# Altium schematic sheet HardwareSetup.SchDoc
size A
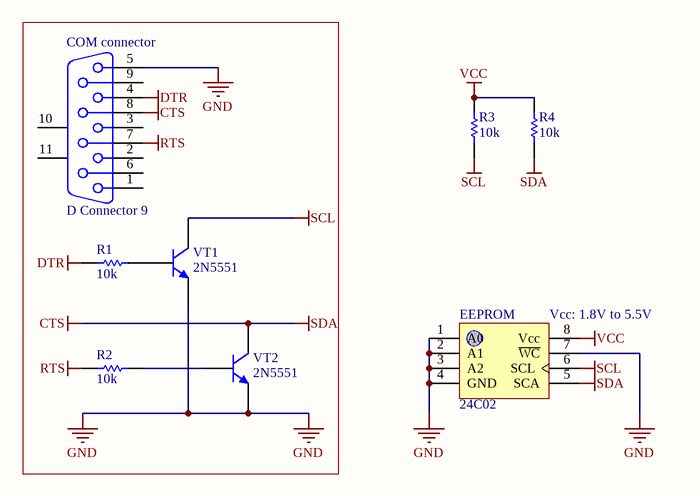
[diagram p0: HardwareSetup.SchDoc]

## Parts
COM_connector  D Connector 9  [DSUB1.385-2H9]
EEPROM  24C02  [DIP-8]
R1  value 10k  [AXIAL-0.3]  (hidden comment: R1)
R2  value 10k  [AXIAL-0.3]  (hidden comment: R1)
R3  value 10k  [AXIAL-0.3]  (hidden comment: R1)
R4  value 10k  [AXIAL-0.3]  (hidden comment: R1)
VT1  2N5551  [TO-92B]
VT2  2N5551  [TO-92B]

## Nets
CTS: COM_connector.8 EEPROM.5(SCA) R4.1 VT2.3(C)  [also labelled SDA]
DTR: COM_connector.4 R1.1
GND: COM_connector.5 EEPROM.1(A0) EEPROM.2(A1) EEPROM.3(A2) EEPROM.4(GND) EEPROM.7(~{WC}) VT1.1(E) VT2.1(E)
RTS: COM_connector.7 R2.1
SCL: EEPROM.6(SCL) R3.1 VT1.3(C)
VCC: EEPROM.8(Vcc) R3.2 R4.2
NetR1_2: R1.2 VT1.2(B)
NetR2_2: R2.2 VT2.2(B)

Not connected (* = marked no-connect by the designer): COM_connector 1 2 3 6 9 10(MH1) 11(MH2)

## Notes on the sheet
- (near EEPROM) Vcc: 1.8V to 5.5V

## Library data of the parts
COM_connector = D Connector 9: Receptacle Assembly, 9 Position, Right Angle; PackageDocument: O; Positions: 9; Published: 15-Jun-2001; LatestRevisionDate: 17-Jul-2002; LatestRevisionNote: Re-released for DXP Platform.; DatasheetDocument: 1-Sep-1999; PackageReference: 788750; Publisher: Altium Limited; Orientation: Right Angle; Gender: Receptacle
R1-R4 = Res1: Resistor; Published: 8-Jun-2000; LatestRevisionDate: 17-Jul-2002; LatestRevisionNote: Re-released for DXP Platform.; PackageReference: AXIAL-0.3; Publisher: Altium Limited; PackageDescription: Axial Device, Thru-Hole; 2 Leads; 0.3 in Pin Spacing
VT1 VT2 = NPN_2N5551: Vceo: *; Vcbo: *; Ice: *; Beta: *